# Altium schematic sheet subtracter.SchDoc
size A4
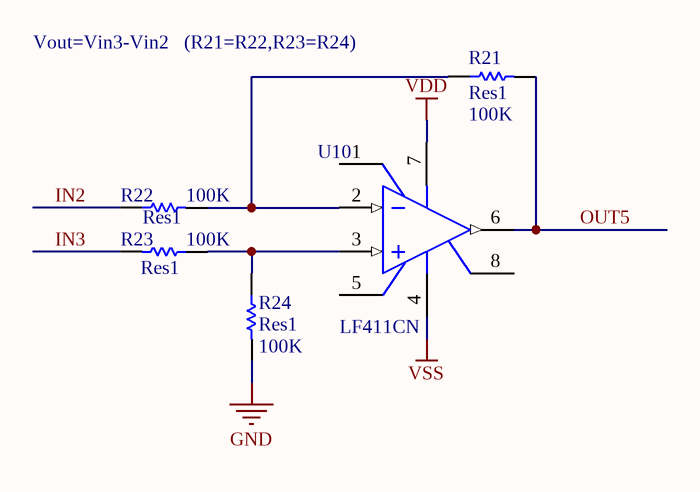
[diagram p0: subtracter.SchDoc]

## Parts
R21  Res1  value 100K  [AXIAL-0.3]
R22  Res1  value 100K  [AXIAL-0.3]
R23  Res1  value 100K  [AXIAL-0.3]
R24  Res1  value 100K  [AXIAL-0.3]
U10  LF411CN  [N08E]

## Nets
GND: R24.2
VDD: U10.7(V+)
VSS: U10.4(V-)
IN2: R22.1
IN3: R23.2
OUT5: R21.2 U10.6(OUT)
NetR21_1: R21.1 R22.2 U10.2(IN-)
NetR23_1: R23.1 R24.1 U10.3(IN+)

Not connected (* = marked no-connect by the designer): U10 1(BAL) 5(BAL) 8(NC)

## Notes on the sheet
- Vout=Vin3-Vin2   (R21=R22,R23=R24)

## Library data of the parts
R21-R24 = Res1: Resistor; Published: 8-Jun-2000; LatestRevisionDate: 17-Jul-2002; LatestRevisionNote: Re-released for DXP Platform.; PackageReference: AXIAL-0.3; Publisher: Altium Limited; PackageDescription: Axial Device, Thru-Hole; 2 Leads; 0.3 in Pin Spacing
U10 = LF411CN: Low Offset, Low Drift JFET Input Operational Amplifier, 8-pin MDIP; Manufacturer: National Semiconductor; PackageTopMarking: NSUZXYTTE#*LF*411CN; PowerWise: N; CompType: Amplifiers; Published: 4-Dec-2008; LatestRevisionDate: 13-Jan-2009; LatestRevisionNote: Sim Model Added.; DatasheetVersion: Aug-2000; PackageVersion: revG, May-2006; PackageReference: N08E; Publisher: Altium Limited; PackageDescription: MDIP, .365 x .250 x .130in, 8 Lead, .100in Pitch; Supplier 1: Farnell; Supplier Part Number 1: 9487026; PartNumber: LF411CN; RoHS: N; PinCount: 8; Code_JEDEC: MS-001-BA; ComponentLink1Description: LF411 Datasheet; ComponentLink1URL: http://www.national.com/ds/LF/LF411.pdf; ComponentLink2Description: LF411 Web Page; ComponentLink2URL: http://www.national.com/pf/LF/LF411.html; ComponentLink3Description: N08E Package Page; ComponentLink3URL: http://www.national.com/packaging/folders/n08e.html